# Altium schematic sheet Motor.SchDoc
size A4
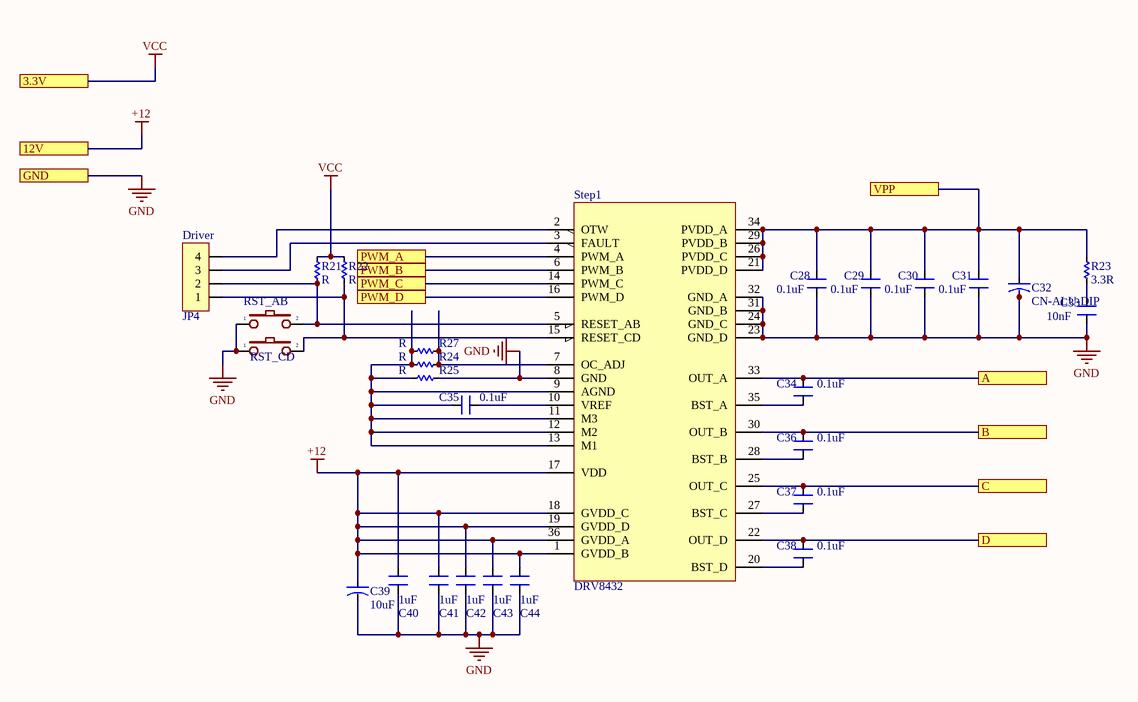
[diagram p0: Motor.SchDoc]

## Parts
C28  0.1uF  [CN-SMD-0603_big]
C29  0.1uF  [CN-SMD-0603_big]
C30  0.1uF  [CN-SMD-0603_big]
C31  0.1uF  [CN-SMD-0603_big]
C32  CN-ALU-DIP  [CA-ALU-5R]
C33  10nF  [CN-SMD-0603_big]
C34  0.1uF  [CN-SMD-0805]
C35  0.1uF  [CN-SMD-0603_big]
C36  0.1uF  [CN-SMD-0603_big]
C37  0.1uF  [CN-SMD-0603_big]
C38  0.1uF  [CN-SMD-0805]
C39  10uF  [CAP-ALU-SMD-6.3x7.7x2.2]
C40  1uF  [CN-SMD-0603_big]
C41  1uF  [CN-SMD-0603_big]
C42  1uF  [CN-SMD-0603_big]
C43  1uF  [CN-SMD-0603_big]
C44  1uF  [CN-SMD-0603_big]
Driver  JP4  [JP4-C1T]
R21  R  [RES-SMD-0603_BIG]
R22  R  [RES-SMD-0603_BIG]
R23  3.3R  [RES-SMD-0603_BIG]
R24  R  [RES-SMD-0603_BIG]
R25  R  [RES-SMD-0603_BIG]
R27  R  [RES-SMD-0603_BIG]
RST_AB  SW  [SW1-SMD]  (value not drawn)
RST_CD  SW  [SW1-SMD]  (value not drawn)
Step1  DRV8432  [DRV8432]  (net tie)

## Ports
3.3V, 12V, A, B, C, D, GND, PWM_A, PWM_B, PWM_C, PWM_D, VPP

## Nets
+12: C39.1 C40.2 C41.2 C42.2 C43.2 C44.2 Step1.1(GVDD_B) Step1.17(VDD) Step1.18(GVDD_C) Step1.19(GVDD_D) Step1.36(GVDD_A) ; port 12V
GND: C28.1 C29.1 C30.1 C31.1 C32.2 C33.1 C39.2 C40.1 C41.1 C42.1 C43.1 C44.1 R25.1 RST_AB.1 RST_CD.1 Step1.8(GND) Step1.23(GND_D) Step1.24(GND_C) Step1.31(GND_B) Step1.32(GND_A) ; port GND
VCC: R21.1 R22.1 ; port 3.3V
A: C34.2 Step1.33(OUT_A) ; port A
B: C36.2 Step1.30(OUT_B) ; port B
C: C37.2 Step1.25(OUT_C) ; port C
D: C38.2 Step1.22(OUT_D) ; port D
PWM_A: Step1.4(PWM_A) ; port PWM_A
PWM_B: Step1.6(PWM_B) ; port PWM_B
PWM_C: Step1.14(PWM_C) ; port PWM_C
PWM_D: Step1.16(PWM_D) ; port PWM_D
VPP: C28.2 C29.2 C30.2 C31.2 C32.1 R23.1 Step1.21(PVDD_D) Step1.26(PVDD_C) Step1.29(PVDD_B) Step1.34(PVDD_A) ; port VPP
NetC33_2: C33.2 R23.2
NetC34_1: C34.1 Step1.35(BST_A)
NetC35_1: C35.1 Step1.10(VREF)
NetC35_2: C35.2 R24.2 R25.2 R27.2 Step1.9(AGND) Step1.11(M3) Step1.12(M2) Step1.13(M1)
NetC36_1: C36.1 Step1.28(BST_B)
NetC37_1: C37.1 Step1.27(BST_C)
NetC38_1: C38.1 Step1.20(BST_D)
NetDriver_1: Driver.1 R22.2 RST_CD.2 Step1.15(RESET_CD)
NetDriver_2: Driver.2 R21.2 RST_AB.2 Step1.5(RESET_AB)
NetDriver_3: Driver.3 Step1.3(FAULT)
NetDriver_4: Driver.4 Step1.2(OTW)
NetR24_1: R24.1 R27.1 Step1.7(OC_ADJ)

## Library data of the parts
C28-C31 C33-C38 C40-C44 = CN: Value: 33pF
C32 = CN-ALU-DIP: Capacitor (Semiconductor SIM Model); Value: 104; LatestRevisionDate: 17-Jul-2002; LatestRevisionNote: Re-released for DXP Platform.; PackageReference: C1206; Publisher: Altium Limited
C39 = CN-ALU-SMD: Polarized Capacitor (Axial); Published: 8-Jun-2000; LatestRevisionDate: 17-Jul-2002; LatestRevisionNote: Re-released for DXP Platform.; PackageReference: POLAR0.8; Publisher: Altium Limited
Driver = JP4: WR-PHD 2.54 mm Angled Socket Header; Manufacturer: W¨¹rth Elektronik eiSos GmbH; partNo: 613004143121; ComponentLink1 Description: Manufacturer; ComponentLink2 Description: Datasheet; NoPins: 04; Created Date: 29 March 2013; ComponentLink1URL: http://www.we-online.com; ComponentLink2URL: http://katalog.we-online.de/em/datasheet/6130xx143121.pdf; Created by: Karrer Zheng
R23 = R
RST_AB RST_CD = SW2: Switch button 2 pin; Value: SW chip 2 pin
Step1 = DRV8432: https://www.digikey.com/product-detail/en/texas-instruments/DRV8432DKDR/296-29573-2-ND/2353367; ComponentLink1Description: Datasheet; ComponentLink1URL: https://www.ti.com/lit/ds/symlink/drv8432.pdf; ComponentLink2Description: BOM; ComponentLink2URL: https://www.digikey.com/product-detail/en/texas-instruments/DRV8432DKDR/296-29573-2-ND/2353367